# Altium schematic sheet MCU1.SchDoc: LiveDesign Evaluation - Serial
size A4; Organization: Altium Limited; Address1: L3, 12a Rodborough Rd; Address2: Frenchs Forest; Address3: NSW; Address4: Australia 2086; DocumentNumber: 3; SheetNumber: 3; SheetTotal: 7
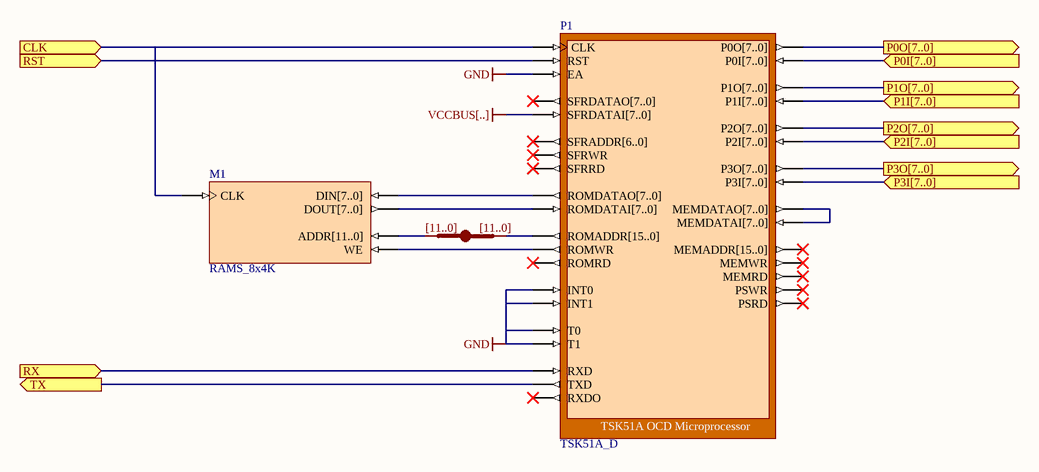
[diagram p0: MCU1.SchDoc]

## Parts
JB_S1  IndexA: [11..0]  (hidden comment: JB)
M1  RAMS_8x4K
P1  TSK51A_D

## Ports
CLK (in), P0I[7..0] (in), P0O[7..0] (out), P1I[7..0] (in), P1O[7..0] (out), P2I[7..0] (in), P2O[7..0] (out), P3I[7..0] (in), P3O[7..0] (out), RST (in), RX (in), TX (out)

## Nets
GND: P1.EA P1.INT0 P1.INT1 P1.T0 P1.T1
VCCBUS[..]: P1.SFRDATAI[7..0]
CLK: M1.CLK P1.CLK ; port CLK
P0I[7..0]: P1.P0I[7..0] ; port P0I[7..0]
P0O[7..0]: P1.P0O[7..0] ; port P0O[7..0]
P1I[7..0]: P1.P1I[7..0] ; port P1I[7..0]
P1O[7..0]: P1.P1O[7..0] ; port P1O[7..0]
P2I[7..0]: P1.P2I[7..0] ; port P2I[7..0]
P2O[7..0]: P1.P2O[7..0] ; port P2O[7..0]
P3I[7..0]: P1.P3I[7..0] ; port P3I[7..0]
P3O[7..0]: P1.P3O[7..0] ; port P3O[7..0]
RST: P1.RST ; port RST
RX: P1.RXD ; port RX
TX: P1.TXD ; port TX
NetJB_S1_A[0..0]: JB_S1.A[0..0] P1.ROMADDR[15..0]
NetJB_S1_B[0..0]: JB_S1.B[0..0] M1.ADDR[11..0]
NetM1_DIN[7..0]: M1.DIN[7..0] P1.ROMDATAO[7..0]
NetM1_DOUT[7..0]: M1.DOUT[7..0] P1.ROMDATAI[7..0]
NetM1_WE: M1.WE P1.ROMWR
NetP1_MEMDATAI[7..0]: P1.MEMDATAI[7..0] P1.MEMDATAO[7..0]

Not connected (* = marked no-connect by the designer): P1 MEMADDR[15..0]* MEMRD* MEMWR* PSRD* PSWR* ROMRD* RXDO* SFRADDR[6..0]* SFRDATAO[7..0]* SFRRD* SFRWR*

## Notes on the sheet
- Title
- Size:
- Date:
- A4
- Number:
- Time:
- Revision:
- Sheet
- of
- File:

## Library data of the parts
JB_S1 = JB: System BUS Joiner; Published: 29-Jan-2004; Publisher: Altium Limited; Core Revision: 1.00.00; IndexB: [11..0]
M1 = RAMS_8x4K: Single Port RAM; Memory_Depth: 4096; Memory_Type: RAM_SinglePortBlock; Memory_Width: 8; Memory_ClockEdge: Rising; Nexus_Core: Memory_Program; Memory_EnablePin: False; Published: 23/04/2004; Publisher: Altium Hobart Technology Center
P1 = TSK51A_D: TSK51A OCD Microprocessor; NEXUS_CORE: Processor_OCDS; NEXUS_JTAG_DEVICE: True; NEXUS_JTAG_ORDER: 0; ChildModel1: RAM256x8_TSK51D; ChildCore1: M1; Memory_Configuration: Record[NEXUS_CORE]{}ComponentDesignator[iram]{}Memory_Depth[256]{}Memory_UsageType[ram]{}ProgramDownloadAddress[0x0]{}Memory_BusType[c51:idata_bus]{n}Record[NEXUS_CORE]{}ComponentDesignator[xram]{}Memory_Depth[64k]{}Memory_UsageType[ram]{}ProgramDownloadAddress[0x0]{}Memory_BusType[c51:xdata_bus]{n}Record[NEXUS_CORE]{}ComponentDesignator[xrom]{}Memory_Depth[64k]{}Memory_UsageType[rom]{}ProgramDownloadAddress[0x0]{}Memory_BusType[c51:code_bus]{n}; Published: 18/12/2003; Publisher: Altium Hobart Technology Centre; Core Revision: 1.00.00